# EasyEDA schematic SCH_BlackRacer_team.json
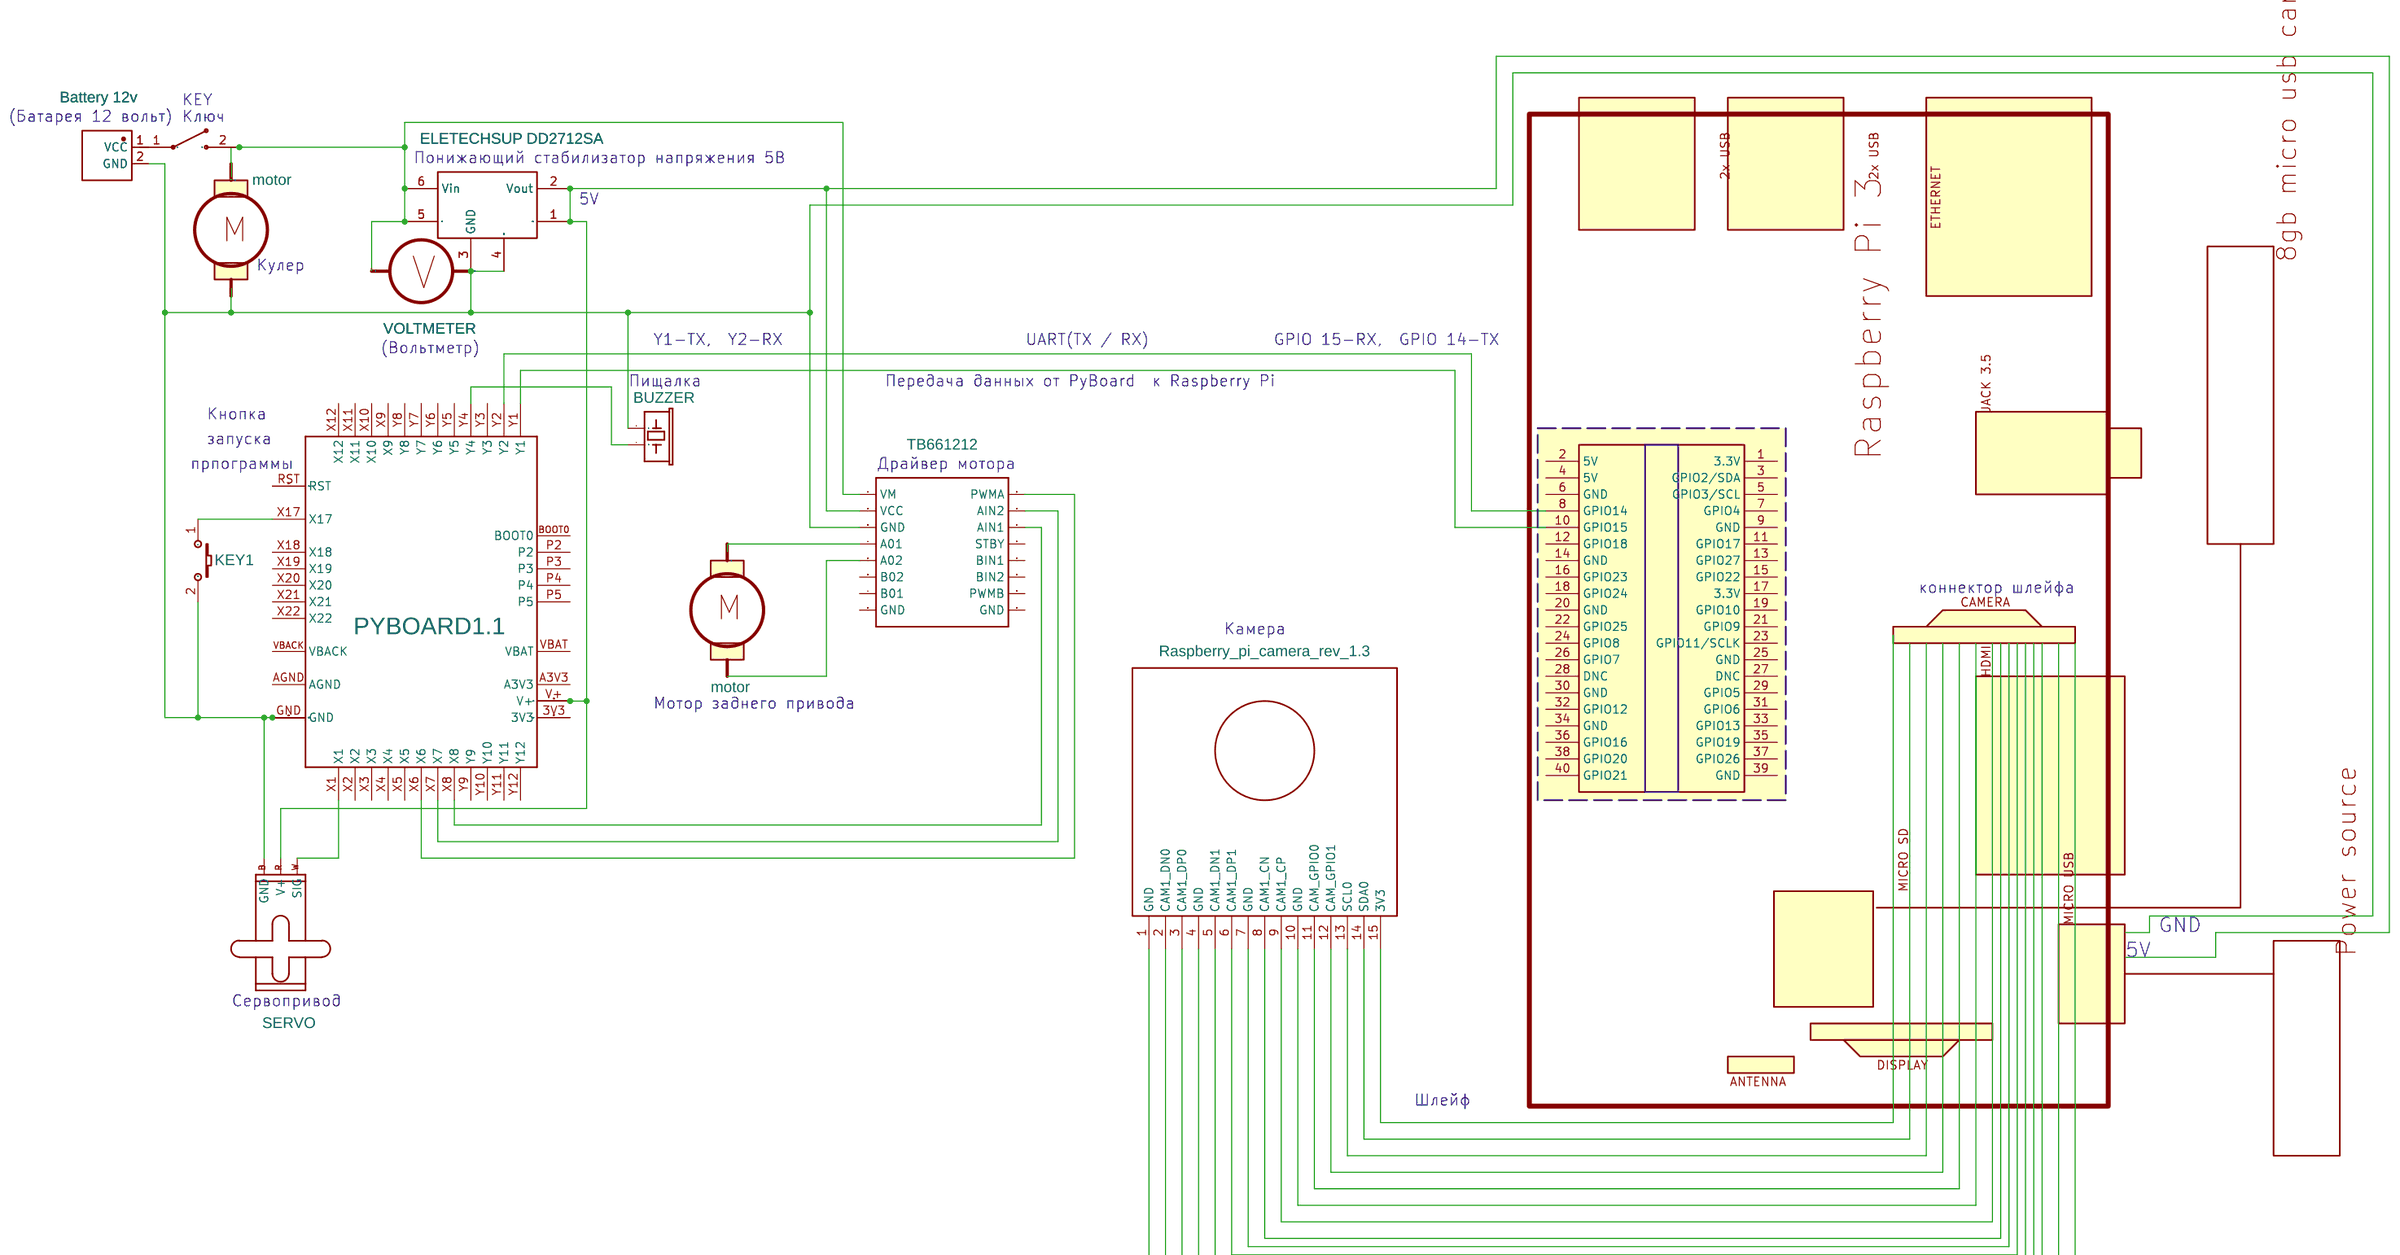
[diagram p0: schematic sheet]

## Parts
1  PYBOARD1.1  [PYBOARD]
KEY1  K2-3.6×6.1_SMD  [KEY-SMD_2P-L6.2-W3.6-LS8.0]
M1  SERVO  [1X03]
M2  motor
M4  motor
P1  VOLTMETER  [2PIN]
SG1  BUZZER  [BUZZER-12MM-NS-KIT]
U1  ELETECHSUP DD2712SA  [DD2712SA]
U2  Raspberry Pi
U4  Battery 12v
U5  Raspberry_pi_camera_rev_1.3
U7  Botton
U9  TB661212  [DUAL TB6612FNG]

## Library data of the parts
1 = PYBOARD1.1: Contributor: Ben Howard
KEY1 = K2-3.6×6.1_SMD: Supplier Part: C118141; Supplier: LCSC; Manufacturer Part: K2-1107ST-A4SW-06; Contributor: LCEDA_Lib; 制造商: 韩国韩荣
M1 = SERVO: Contributor: ZegesMenden
M2 M4 = motor
P1 = VOLTMETER_XL
SG1 = BUZZER: Contributor: SparkFun
U1 = DD2712SA: Manufacturer: eletechsup; Supplier: Aliexpress; link: https://aliexpress.com/item/32817933017.html; Contributor: nivie
U2 = Raspberry Pi: Manufacturer Part: RASPBERRY PI 3 Model B; Supplier Part: Raspberry Pi 3-B; Supplier: Raspberry; link: https://www.raspberrypi.org/products/raspberry-pi-3-model-b/; Contributor: Przemek
U4 = Battery: Contributor: greandotcom
U5 = Raspberry_pi_camera_rev_1.3: Contributor: MiDem
U7 = Botton: Manufacturer: RSB; Manufacturer Part: 2A080; Supplier Part: 12131; Contributor: Krusad
U9 = TB661212: TB6612 The TB6612FNG motor driver can control up to two DC motors at a constant current of 1.2A (3.2A peak).; Contributor: 陳文豪

## Nets
Net-(1-3V3): 1.3V3 1.3V3-1(3V3)
Net-(1-GND): 1.GND 1.GND0(GND) 1.GND1(GND) 1.GND2(GND) 1.GND3(GND) 1.GND4(GND) 1.GND5(GND) 1.GND6(GND) KEY1.2 M1.3(GND) P1.2(B) SG1.+(1) U1.3(GND) U1.4(GND) U4.2(GND) U9.GND
Net-(1-RST): 1.RST 1.RST1(RST)
Net-(1-V+): 1.V+ 1.V+1(V+) 1.V+2(V+) 1.V+3(V+) 1.V+4(V+) 1.V+5(V+) 1.V+6(V+) M1.2(V+) U1.1(Vout) U1.2(Vout) U9.VCC
Net-(1-X1): 1.X1 M1.1(SIG)
Net-(1-X6): 1.X6 U9.16(PWMA)
Net-(1-X7): 1.X7 U9.15(AIN2)
Net-(1-X8): 1.X8 U9.14(AIN1)
Net-(1-X17): 1.X17 KEY1.1
Net-(1-Y1): 1.Y1 U2.10(GPIO15)
Net-(1-Y2): 1.Y2 U2.8(GPIO14)
Net-(1-Y4): 1.Y4 SG1.-(2)
Net-(M2-2): M2.2 P1.1(A) U1.5(Vin) U1.6(Vin) U7.2(1) U9.VM

Not connected (* = marked no-connect by the designer): 1 A3V3 AGND BOOT0 P2 P3 P4 P5 VBACK VBAT X2 X3 X4 X5 X9 X10 X11 X12 X18 X19 X20 X21 X22 Y3 Y5 Y6 Y7 Y8 Y9 Y10 Y11 Y12; M4 2; U2 1(3.3V) 2(5V) 3(GPIO2/SDA) 4(5V) 5(GPIO3/SCL) 6(GND) 7(GPIO4) 9(GND) 11(GPIO17) 12(GPIO18) 13(GPIO27) 14(GND) 15(GPIO22) 16(GPIO23) 17(3.3V) 18(GPIO24) 19(GPIO10) 20(GND) 21(GPIO9) 22(GPIO25) 23(GPIO11/SCLK) 24(GPIO8) 25(GND) 26(GPIO7) 27(DNC) 28(DNC) 29(GPIO5) 30(GND) 31(GPIO6) 32(GPIO12) 33(GPIO13) 34(GND) 35(GPIO19) 36(GPIO16) 37(GPIO26) 38(GPIO20) 39(GND) 40(GPIO21); U4 1(VCC); U5 1(GND) 2(CAM1_DN0) 3(CAM1_DP0) 4(GND) 5(CAM1_DN1) 6(CAM1_DP1) 7(GND) 8(CAM1_CN) 9(CAM1_CP) 10(GND) 11(CAM_GPIO0) 12(CAM_GPIO1) 13(SCL0) 14(SDA0) 15(3V3); U7 1(2); U9 4(A01) 5(A02) 6(B02) 7(B01) 8(GND) 10(PWMB) 11(BIN2) 12(BIN1) 13(STBY) 56(GND)

## Notes on the sheet
- KEY
- (Батарея 12 вольт)
- Ключ
- Понижающий стабилизатор напряжения 5В
- 5V
- Кулер
- Y1-TX,  Y2-RX
- UART(TX / RX)
- GPIO 15-RX,  GPIO 14-TX
- (Вольтметр)
- Пищалка
- Передача данных от PyBoard  к Raspberry Pi
- Кнопка
- запуска
- прпограммы
- Драйвер мотора
- коннектор шлейфа
- Камера
- Мотор заднего привода
- GND
- 5V
- Сервопривод
- Шлейф
